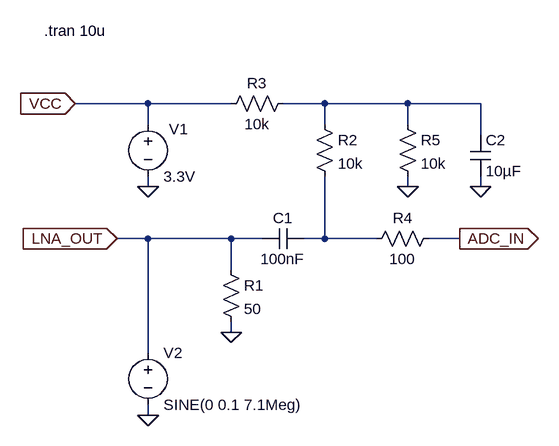
[diagram p0: schematic adc_adapter.asc]
adc_adapter.asc, the LTspice schematic file:
Version 4
SHEET 1 880 784
WIRE -48 288 -160 288
WIRE 80 288 -48 288
WIRE 224 288 160 288
WIRE 352 288 224 288
WIRE 464 288 352 288
WIRE -48 320 -48 288
WIRE 224 320 224 288
WIRE 352 320 352 288
WIRE 464 336 464 288
WIRE -48 416 -48 400
WIRE 352 416 352 400
WIRE 464 416 464 400
WIRE -48 496 -96 496
WIRE 80 496 -48 496
WIRE 128 496 80 496
WIRE 224 496 224 400
WIRE 224 496 192 496
WIRE 304 496 224 496
WIRE 432 496 384 496
WIRE 80 544 80 496
WIRE 80 640 80 624
WIRE -48 672 -48 496
WIRE -48 768 -48 752
FLAG 432 496 ADC_IN
IOPIN 432 496 Out
FLAG -160 288 VCC
IOPIN -160 288 In
FLAG 80 640 0
FLAG 352 416 0
FLAG 464 416 0
FLAG -48 416 0
FLAG -48 768 0
FLAG -96 496 LNA_OUT
IOPIN -96 496 In
SYMBOL cap 192 480 R90
WINDOW 0 0 32 VBottom 2
WINDOW 3 32 32 VTop 2
SYMATTR InstName C1
SYMATTR Value 100nF
SYMBOL res 64 528 R0
SYMATTR InstName R1
SYMATTR Value 50
SYMBOL res 208 304 R0
SYMATTR InstName R2
SYMATTR Value 10k
SYMBOL res 176 272 R90
WINDOW 0 0 56 VBottom 2
WINDOW 3 32 56 VTop 2
SYMATTR InstName R3
SYMATTR Value 10k
SYMBOL cap 448 336 R0
SYMATTR InstName C2
SYMATTR Value 10µF
SYMBOL res 400 480 R90
WINDOW 0 0 56 VBottom 2
WINDOW 3 32 56 VTop 2
SYMATTR InstName R4
SYMATTR Value 100
SYMBOL res 336 304 R0
SYMATTR InstName R5
SYMATTR Value 10k
SYMBOL voltage -48 304 R0
WINDOW 0 32 23 Left 2
SYMATTR InstName V1
SYMATTR Value 3.3V
SYMBOL voltage -48 656 R0
SYMATTR InstName V2
SYMATTR Value SINE(0 0.1 7.1Meg)
TEXT -208 176 Left 2 !.tran 10u

The netlist it stands for:
* adc_adapter.asc
C1 N002 LNA_OUT 100nF
R1 LNA_OUT 0 50
R2 N001 N002 10k
R3 N001 VCC 10k
C2 N001 0 10µF
R4 ADC_IN N002 100
R5 N001 0 10k
V1 VCC 0 3.3V
V2 LNA_OUT 0 SINE(0 0.1 7.1Meg)
.tran 10u
.backanno
.end